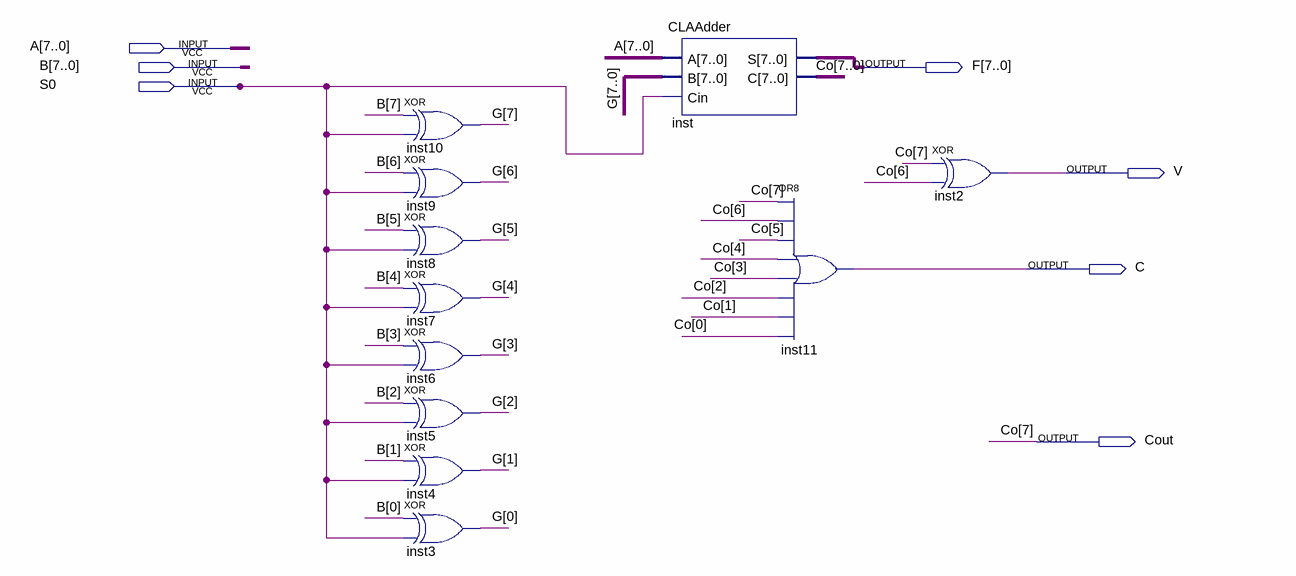
[diagram p0: schematic sheet]
// Quartus schematic ArithmeticUnit.bdf as structural Verilog: 11 symbols, 7 pins
module ArithmeticUnit (
  input  [7:0] A,
  input  [7:0] B,
  input  S0,
  output [7:0] F,
  output V,
  output C,
  output Cout
);

  wire [6:0] Co;
  wire [7:0] G;

  xor inst10 (G[7], B[7], S0);
  xor inst9 (G[6], B[6], S0);
  xor inst8 (G[5], B[5], S0);
  xor inst7 (G[4], B[4], S0);
  xor inst6 (G[3], B[3], S0);
  xor inst5 (G[2], B[2], S0);
  xor inst4 (G[1], B[1], S0);
  xor inst3 (G[0], B[0], S0);
  CLAAdder inst (.A(A), .B(G), .Cin(S0), .S(F), .C({Cout, Co}));
  or inst11 (C, Cout, Co[6], Co[5], Co[4], Co[3], Co[2], Co[1], Co[0]);
  xor inst2 (V, Cout, Co[6]);

  // Other names for the same wires on the sheet: Co[7] = Cout
endmodule
